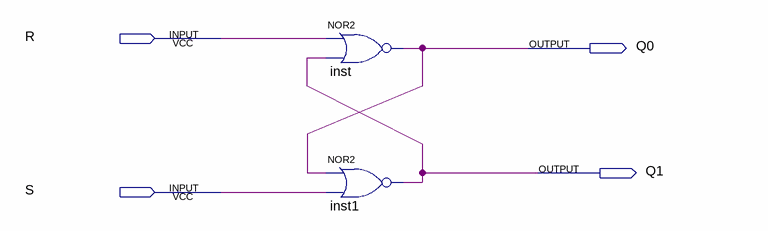
[diagram p0: schematic sheet]
// Quartus schematic latch_sr.bdf as structural Verilog: 2 symbols, 4 pins
module latch_sr (
  input  R,
  input  S,
  output Q0,
  output Q1
);

  nor inst (Q0, R, Q1);
  nor inst1 (Q1, Q0, S);
endmodule
